# EAGLE design PiDuinoSerial (EAGLE 6.4)
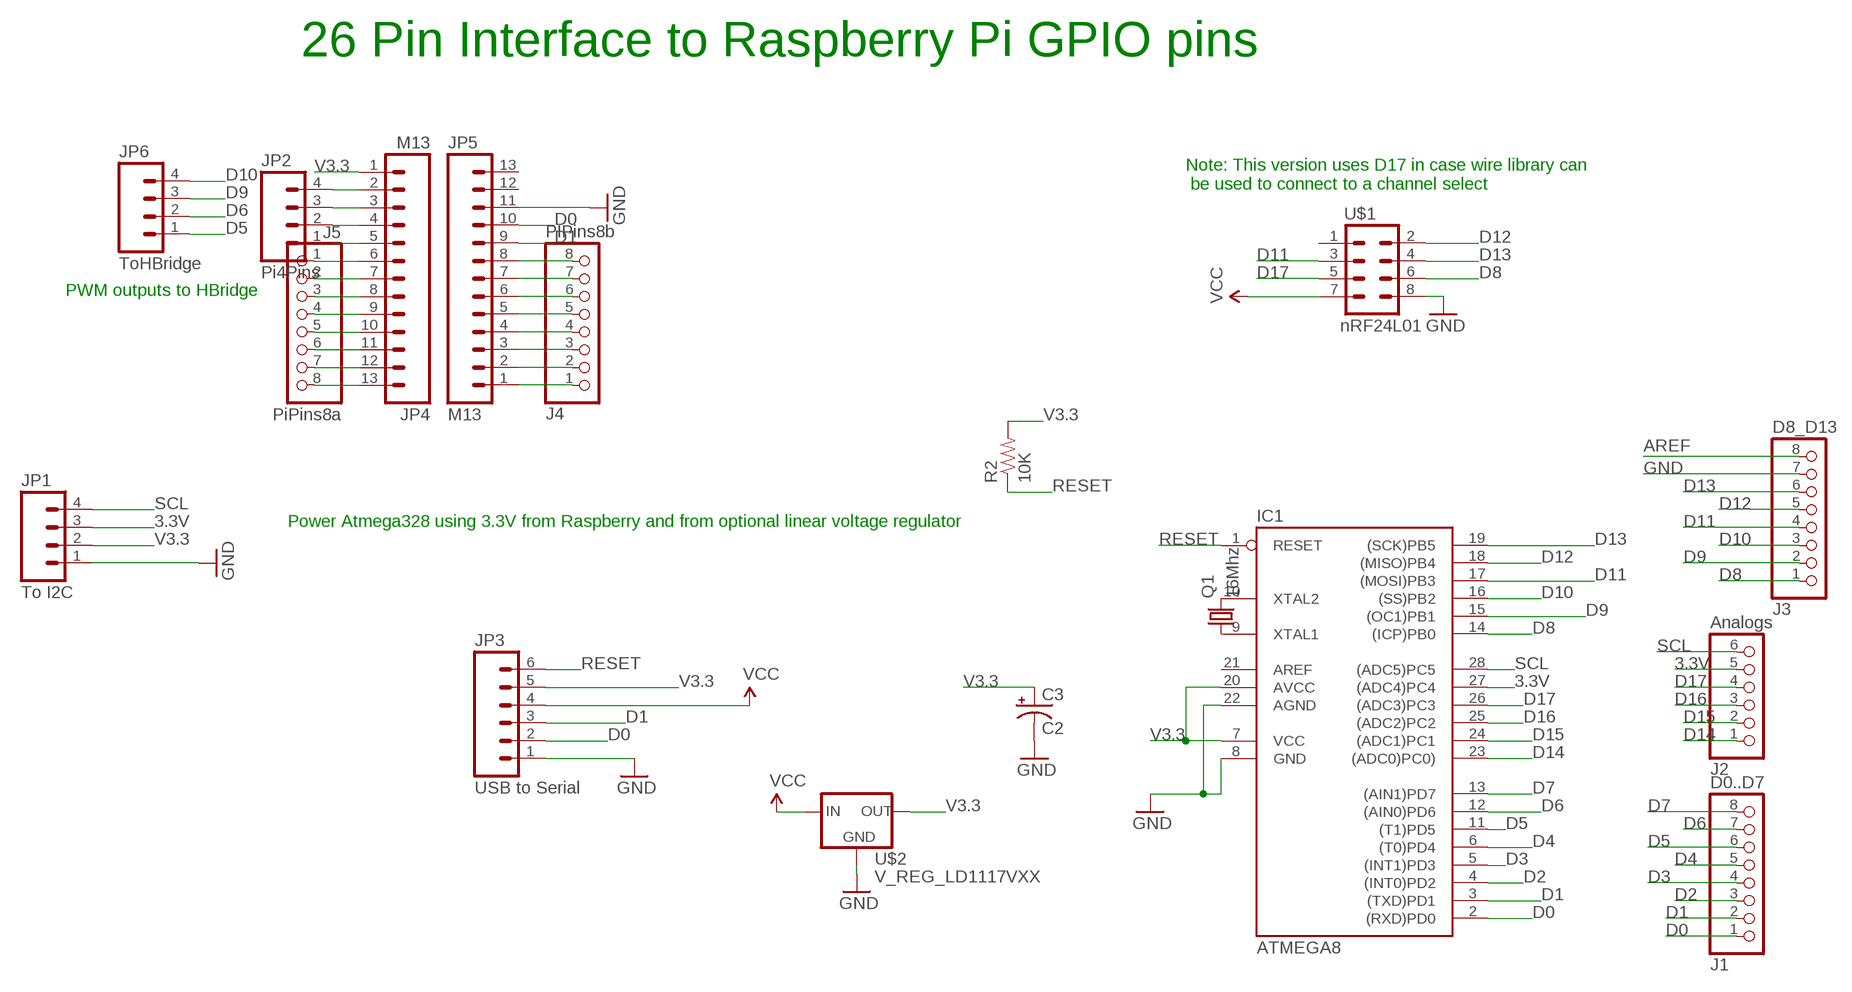
[diagram p0: schematic, sheet 1]

## Parts
C3  C2  CAP_POLPTH1  [CPOL-RADIAL-100UF-25V]
IC1  ATMEGA8  AT90S4433P  [DIL28-3]
J1  D0..D7  PINHD-1X8  [1X08]
J2  Analogs  PINHD-1X6  [1X06]
J3  D8_D13  PINHD-1X8  [1X08]
J4  PIPins8b  PINHD-1X8  [1X08]
J5  PiPins8a  PINHD-1X8  [1X08]
JP1  To I2C  M04PTH  [1X04]
JP2  Pi4Pins  M04PTH  [1X04]
JP3  USB to Serial  M06SIP  [1X06]
JP4  M13  [1X13]
JP5  M13  [1X13]
JP6  ToHBridge  M04PTH  [1X04]
Q1  16Mhz  CRYSTALHC49US  [HC49US]
R2  10K  RESISTORPTH1  [AXIAL-0.3]
U$1  nRF24L01  M04X2  [2X4]
U$2  V_REG_LD1117VXX  [78XXL]

## Nets
3.3V: IC1.27((ADC4)PC4) J2.5 JP1.3
AREF [aref]: J3.8
D0: IC1.2((RXD)PD0) J1.1 JP3.2 JP5.10
D1: IC1.3((TXD)PD1) J1.2 JP3.3 JP5.9
D2: IC1.4((INT0)PD2) J1.3
D3: IC1.5((INT1)PD3) J1.4
D4: IC1.6((T0)PD4) J1.5
D5: IC1.11((T1)PD5) J1.6 JP6.1
D6: IC1.12((AIN0)PD6) J1.7 JP6.2
D7: IC1.13((AIN1)PD7) J1.8
D8: IC1.14((ICP)PB0) J3.1 U$1.6
D9: IC1.15((OC1)PB1) J3.2 JP6.3
D10: IC1.16((SS)PB2) J3.3 JP6.4
D11: IC1.17((MOSI)PB3) J3.4 U$1.3
D12: IC1.18((MISO)PB4) J3.5 U$1.2
D13: IC1.19((SCK)PB5) J3.6 U$1.4
D14: IC1.23((ADC0)PC0)) J2.1
D15: IC1.24((ADC1)PC1) J2.2
D16: IC1.25((ADC2)PC2) J2.3
D17: IC1.26((ADC3)PC3) J2.4 U$1.5
GND [gnd]: C3.2(-) IC1.8(GND) IC1.22(AGND) J3.7 JP1.1 JP3.1 JP5.11 U$1.8 U$2.IN(GND)
N$1: IC1.10(XTAL2) Q1.2
N$2: IC1.9(XTAL1) Q1.1
N$3: J4.1 JP5.1
N$4: J4.2 JP5.2
N$5: J4.3 JP5.3
N$6: J4.4 JP5.4
N$7: J4.5 JP5.5
N$8: J4.6 JP5.6
N$9: J4.7 JP5.7
N$10: J4.8 JP5.8
N$11: J5.1 JP4.6
N$12: J5.2 JP4.7
N$13: J5.3 JP4.8
N$14: J5.4 JP4.9
N$15: J5.5 JP4.10
N$16: J5.6 JP4.11
N$17: J5.7 JP4.12
N$18: J5.8 JP4.13
N$19: JP2.1 JP4.5
N$20: JP2.2 JP4.4
N$21: JP2.3 JP4.3
N$22: JP2.4 JP4.2
RESET: IC1.1(RESET) JP3.6 R2.P$1
SCL: IC1.28((ADC5)PC5) J2.6 JP1.4
V3.3: C3.1(+) IC1.7(VCC) IC1.20(AVCC) JP1.2 JP3.5 JP4.1 R2.P$2 U$2.GND(OUT)
VCC: JP3.4 U$1.7 U$2.OUT(IN)
Unconnected: JP5.12 JP5.13 U$1.1

## Notes on the sheet
- 26 Pin Interface to Raspberry Pi GPIO pins
- Note: This version uses D17 in case wire library can
   be used to connect to a channel select
- PWM outputs to HBridge
- Power Atmega328 using 3.3V from Raspberry and from optional linear voltage regulator

## Power pins joined to a net without a drawn wire
AREF: IC1.21(AREF)

## Library data of the parts
C3 = SparkFun:CAP_POL: Capacitor Polarized These are standard SMD and PTH capacitors. Normally 10uF, 47uF, and 100uF in electrolytic and tantalum varieties. Always verify the external diameter of the through hole cap, it varies with capacity, voltage, and manufacturer. The EIA devices should be standard.
IC1 = atmel:AT90S4433: MICROCONTROLLER 4 Kbytes FLASH 128 bytes SRAM 256 bytes EEPROM UART 6-channel 10 bit ADC
J1 J3-J5 = pinhead:PINHD-1X8: PIN HEADER
J2 = pinhead:PINHD-1X6: PIN HEADER
JP1 JP2 JP6 = SparkFun-Connectors:M04: Header 4 Standard 4-pin 0.1" header. Use with straight break away headers (SKU : PRT-00116), right angle break away headers (PRT-00553), swiss pins (PRT-00743), machine pins (PRT-00117), and female headers (PRT-00115). Molex polarized connector foot print use with SKU : PRT-08231 with associated crimp pins and housings. 1MM SMD Version SKU: PRT-10208
JP3 = SparkFun:M06: Header 6 Standard 6-pin 0.1" header. Use with straight break away headers (SKU : PRT-00116), right angle break away headers (PRT-00553), swiss pins (PRT-00743), machine pins (PRT-00117), and female headers (PRT-00115). Molex polarized connector foot print use with SKU : PRT-08094 with associated crimp pins and housings. NOTES ON THE VARIANTS LOCK and LOCK_LONGPADS... This footprint was designed to help hold the alignment of a through-hole component (i.e. 6-pin header) while soldering it into place. You may notice that each hole has been shifted either up or down by 0.005 of an inch from it's more standard position (which is a perfectly straight line). This slight alteration caused the pins (the squares in the middle) to touch the edges of the holes. Because they are alternating, it causes a "brace" to hold the component in place. 0.005 has proven to be the perfect amount of "off-center" position when using our standard breakaway headers. Although looks a little odd when you look at the bare footprint, once you have a header in there, the alteration is very hard to notice. Also, if you push a header all the way into place, it is covered up entirely on the bottom side. This idea of altering the position of holes to aid alignment will be further integrated into the Sparkfun Library for other footprints. It can help hold any component with 3 or more connection pins.
JP4 JP5 = SparkFun-Connectors:M13: 13-pin single row .1" header
Q1 = SparkFun:CRYSTAL: Crystals Various standard crystals. Proven footprints. Spark Fun Electronics SKU : COM-00534
R2 = SparkFun:RESISTOR: Resistor Basic schematic elements and footprints for 0603, 1206, and PTH 1/10th watt (small) resistors.
U$1 = SparkFun-Connectors:M04X2: .1" header, two rows of four.
U$2 = SparkFun-PowerIC:V_REG_LD1117VXX: LD1117VXX voltage regulator. We carry the 3.3V version (COM-00526) in TO-220 package.

## Net classes
0 default: width 0.254 mm, clearance 0.254 mm
1 power: width 0.61 mm, drill 0.711 mm, clearance 0.33 mm
2 gnd: width 0.305 mm, drill 0.711 mm, clearance 0.254 mm
3 usbvcc: width 0.508 mm, drill 0.711 mm, clearance 0.254 mm
4 aref: width 0.406 mm

## Board
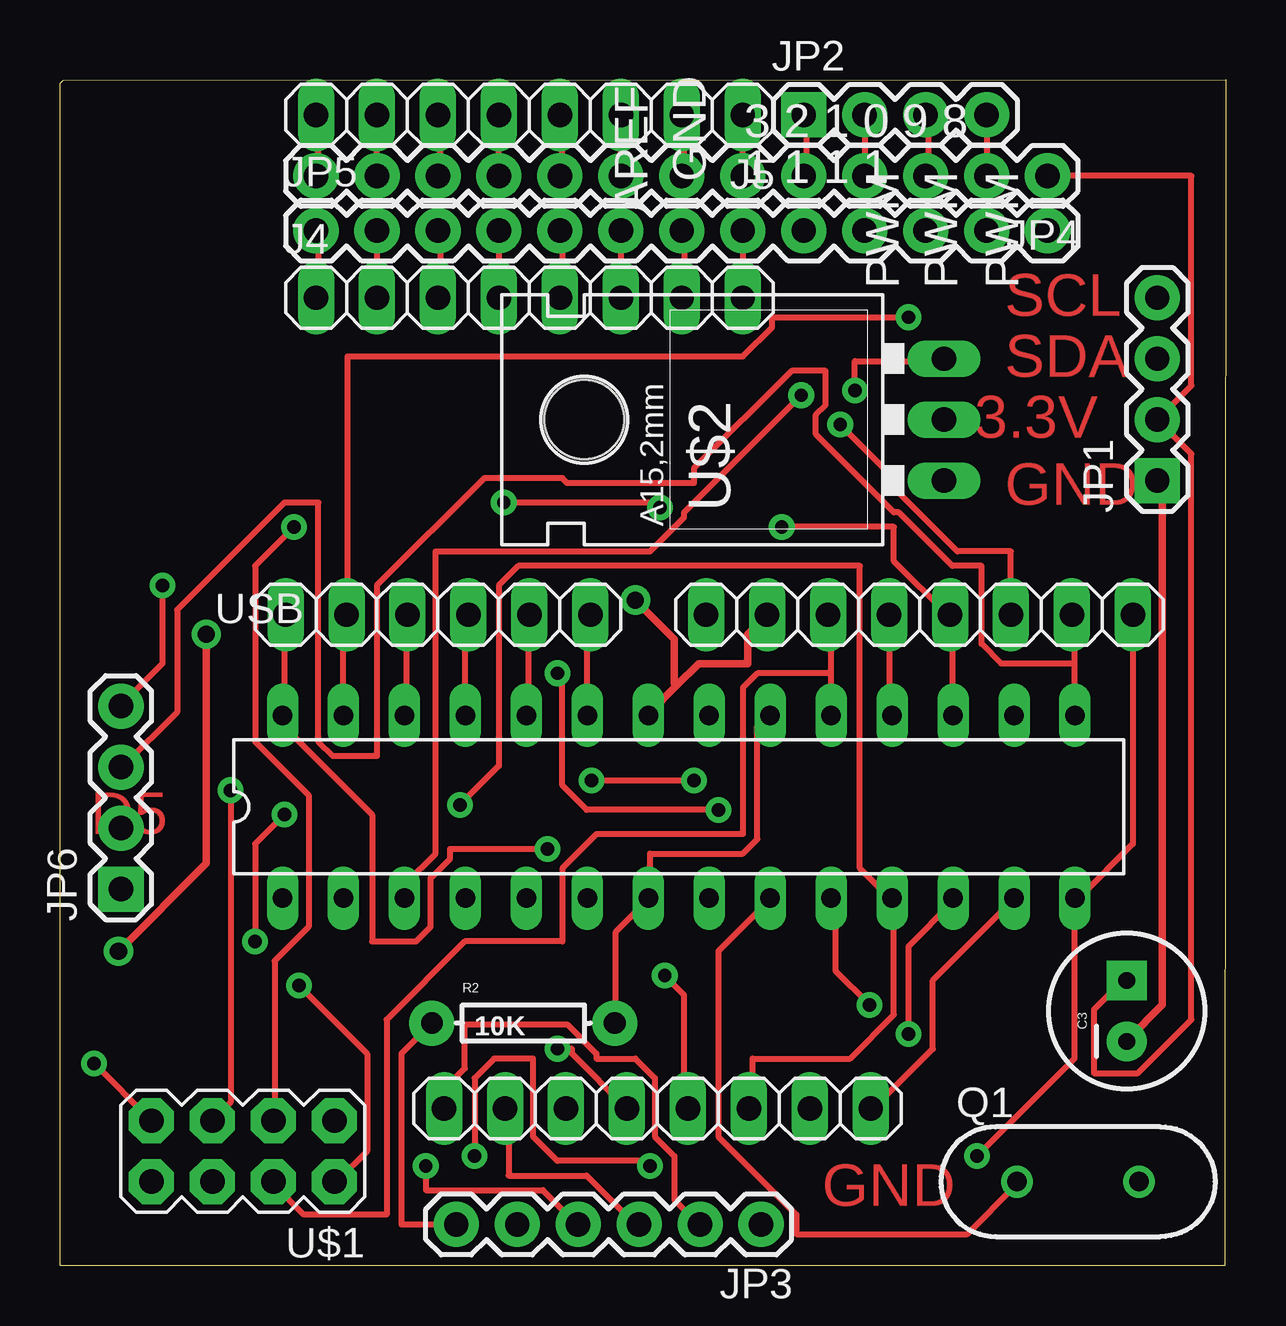
[diagram p1: board, top side]
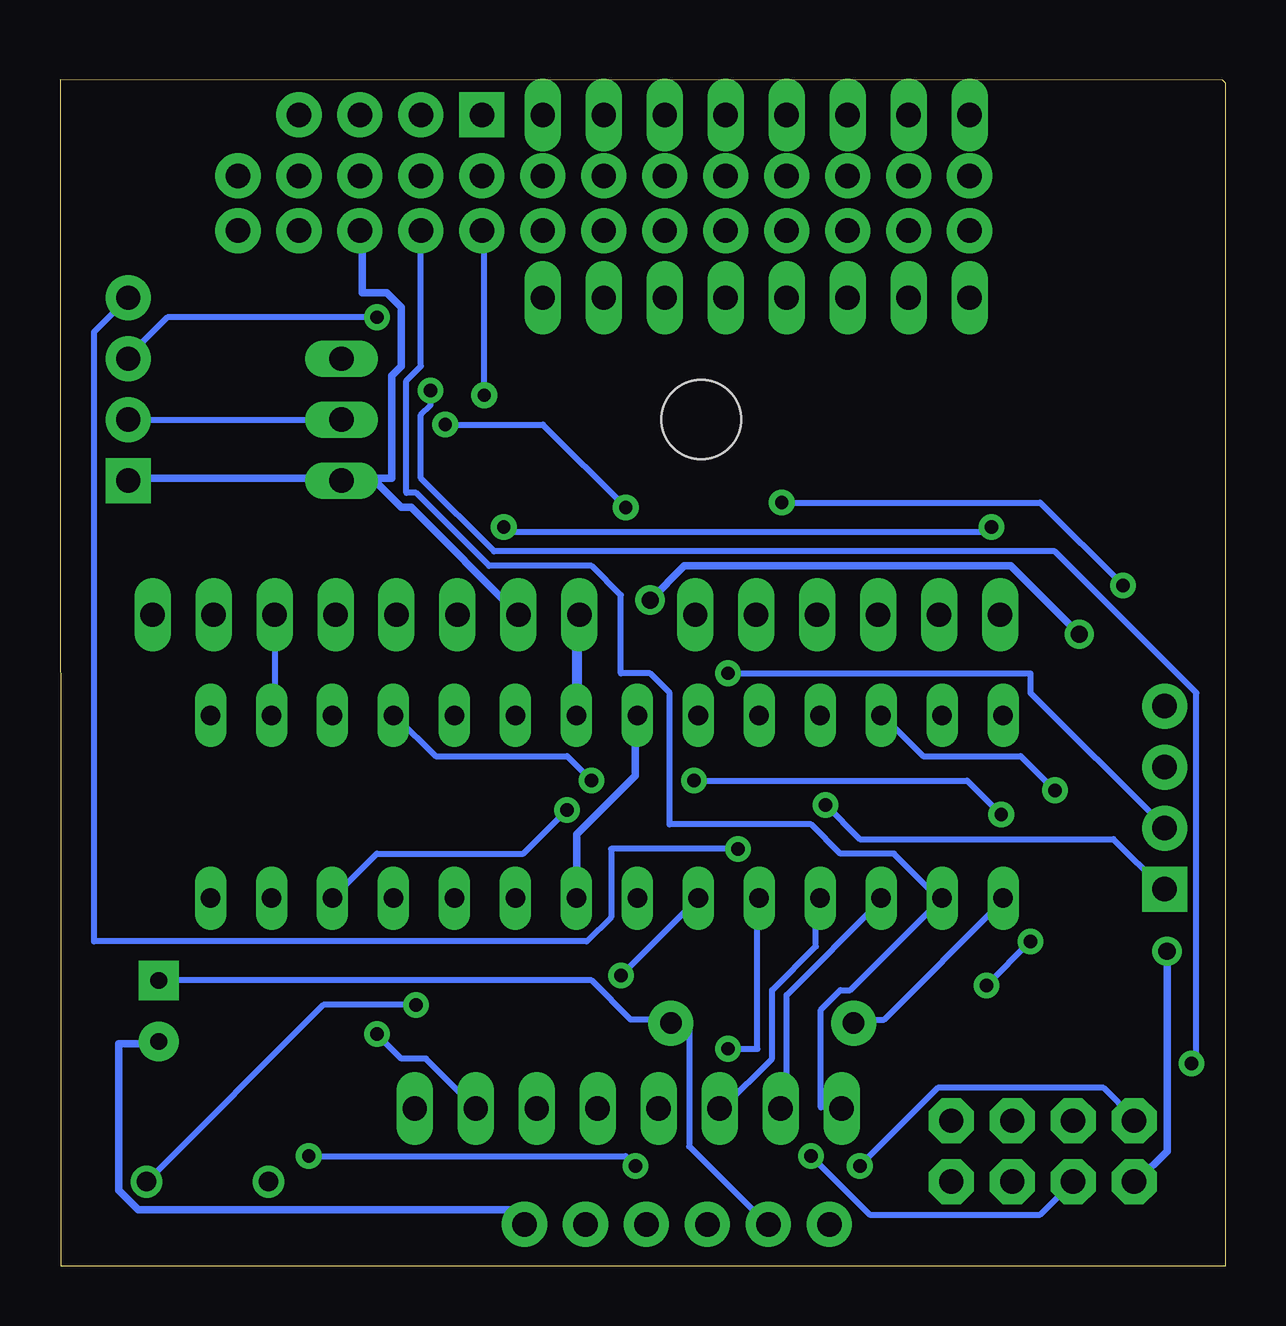
[diagram p2: board, bottom side, seen from below]

Size 48.56 x 49.43 mm. Coordinates in mm from the lower left corner, seen from the top.
Outline: 0,49.28 0.13,49.4 48.56,49.43 48.54,0 0,0 0,49.28
Copper layers (1*16): Top 0.035mm / dielectric 1.5mm / Bottom 0.035mm
Design rules "default": minimum track width 10mil, minimum drill 22mil, track to track 10mil, track to pad 10mil, pad to pad 10mil, via to via 16mil, smd to smd 8mil, copper to edge 30mil, drill to drill 12mil, minimum pad ring 10mil, minimum via ring 10mil, stop-mask expansion 4mil, vias tented up to drill 0mil, thermal gap 10mil
vRestrict: area 25.4,45.2 to 27.1,48.8; area 33.4,40.7 to 34.9,44.3; area 35.9,40.7 to 37.5,44.3; area 38.5,40.7 to 40,44.3; area 42.5,38.3 to 43.1,38.6

### Footprints (pad centres in the part's own frame; a part is rotated, then mirrored left to right if it is on the bottom)
CPOL-RADIAL-100UF-25V = drill 0.7 pad 1.651 square: 1 1.27,0 | drill 0.7 pad 1.651: 2 -1.27,0
DIL28-3 = drill 0.813 long: 1 -16.51,-3.81; 2 -13.97,-3.81; 3 -11.43,-3.81; 4 -8.89,-3.81; 5 -6.35,-3.81; 6 -3.81,-3.81; 7 -1.27,-3.81; 8 1.27,-3.81; 9 3.81,-3.81; 10 6.35,-3.81; 11 8.89,-3.81; 12 11.43,-3.81; 13 13.97,-3.81; 14 16.51,-3.81; 15 16.51,3.81; 16 13.97,3.81; 17 11.43,3.81; 18 8.89,3.81; 19 6.35,3.81; 20 3.81,3.81; 21 1.27,3.81; 22 -1.27,3.81; 23 -3.81,3.81; 24 -6.35,3.81; 25 -8.89,3.81; 26 -11.43,3.81; 27 -13.97,3.81; 28 -16.51,3.81
1X08 = drill 1.016 long: 1 -8.89,0; 2 -6.35,0; 3 -3.81,0; 4 -1.27,0; 5 1.27,0; 6 3.81,0; 7 6.35,0; 8 8.89,0
1X06 = drill 1.016 long: 1 -6.35,0; 2 -3.81,0; 3 -1.27,0; 4 1.27,0; 5 3.81,0; 6 6.35,0
1X04 = drill 1.016 pad 1.88 square: 1 0,0 | drill 1.016 pad 1.88: 2 2.54,0; 3 5.08,0; 4 7.62,0
1X06' = drill 1.016 pad 1.88: 1 0,0; 2 2.54,0; 3 5.08,0; 4 7.62,0; 5 10.16,0; 6 12.7,0
1X13 = drill 1.016 pad 1.88: 1 0,0; 2 2.54,0; 3 5.08,0; 4 7.62,0; 5 10.16,0; 6 12.7,0; 7 15.24,0; 8 17.78,0; 9 20.32,0; 10 22.86,0; 11 25.4,0; 12 27.94,0; 13 30.48,0
HC49US = drill 0.813: 1 -2.54,0; 2 2.54,0
AXIAL-0.3 = drill 0.9 pad 1.88: P$1 -3.81,0; P$2 3.81,0
2X4 = drill 1.016 pad 1.88 octagon: 1 -3.81,-1.27; 2 -3.81,1.27; 3 -1.27,-1.27; 4 -1.27,1.27; 5 1.27,-1.27; 6 1.27,1.27; 7 3.81,-1.27; 8 3.81,1.27
78XXL = drill 1.016 long: GND 0,-3.81; IN -2.54,-3.81; OUT 2.54,-3.81 | hole 3.302: 0,11.176

### Placement (x,y rotation side)
C3  44.45,10.62 90 top
IC1  25.78,19.13 0 top
J1  24.89,6.55 0 top
J2  15.75,27.13 180 top
J3  35.81,27.13 180 top
J4  19.56,40.34 0 top
J5  19.56,47.96 180 top
JP1  45.72,32.72 90 top
JP2  30.99,47.96 0 top
JP3  USB to Serial  [1X06']  29.21,1.73 180 top
JP4  41.15,45.42 180 top
JP5  10.67,43.13 0 top
JP6  2.54,15.7 90 top
Q1  42.42,3.51 0 top
R2  19.3,10.11 0 top
U$1  7.62,4.78 180 top
U$2  33.02,35.26 90 top

### Tracks (layer width: path | path; a pad name or v marks a point on that pad's centre or on a via)
3.3V  (via drill 0.56)
  Top 0.254: IC1.27 11.79,23.06 11.79,27.13 J2.5 11.99,27.13 11.99,37.9 28.45,37.9 29.67,39.12 29.67,39.52 v35.36,39.52
  Bottom 0.254: v35.36,39.52 44.09,39.52 45.72,37.9 JP1.3
AREF
  Bottom 0.406: IC1.21 27.03,23.06 27.03,27.13 J3.8
D0
  Top 0.254: JP3.2 26.62,1.73 25.6,2.74 25.6,4.57 24.79,5.39 24.79,7.82 23.98,8.64 22.35,8.64 22.35,8.84 21.13,10.06 16.87,10.06 16.87,8.23 16.05,7.42 16.05,6.6 J1.1
  Bottom 0.254: J1.1 16.05,6.6 16.87,6.6 16.87,10.67 16.05,11.48 15.65,11.48 IC1.2 11.99,15.34 13.82,17.17 16.05,17.17 17.27,18.39 23.16,18.39 23.16,23.88 23.98,24.69 25.2,24.69 25.2,27.94 26.42,29.16 30.68,29.16 33.73,32.21 34.14,32.21 34.14,36.88 33.53,37.49 JP5.10
D1  (via drill 0.56)
  Top 0.254: JP3.3 23.98,1.73 21.95,3.76 18.69,3.76 18.69,6.4 J1.2 | v30.89,36.27 26.01,31.39 26.01,31.19 24.59,29.77 15.65,29.77 15.65,17.17 14.43,15.95 14.43,15.34 IC1.3
  Bottom 0.254: IC1.3 14.43,15.14 18.29,11.28 18.29,6.6 18.49,6.6 J1.2 | v30.89,36.27 30.89,42.98 JP5.9
D2
  Bottom 0.254: IC1.4 17.07,15.14 17.07,13.31 18.9,11.48 18.9,8.64 20.93,6.6 J1.3
D3  (via drill 0.56)
  Top 0.254: v20.73,9.04 21.34,9.04 21.34,8.84 J1.4
  Bottom 0.254: v20.73,9.04 19.51,9.04 19.51,15.14 IC1.5
D4  (via drill 0.56)
  Top 0.254: v25.2,12.09 26.01,11.28 26.01,6.6 J1.5
  Bottom 0.254: v25.2,12.09 IC1.6
D5  (via drill 0.56)
  Top 0.254: J1.6 28.85,6.6 28.85,8.64 32.92,8.64 34.75,10.47 34.75,15.14 IC1.11 34.54,15.34 33.33,16.56 33.33,29.16 19.1,29.16 18.29,28.35 18.29,20.83 v16.66,19.2
  Bottom 0.254: v16.66,19.2 15.24,17.78 4.67,17.78 2.64,15.75 JP6.1
D6  (via drill 0.56)
  Top 0.254: v35.36,9.65 35.36,13.31 37.19,15.14 IC1.12 | v20.73,24.69 20.93,24.49 20.93,20.02 21.95,19 v27.43,19
  Bottom 0.254: v35.36,9.65 34.34,8.64 33.33,8.64 J1.7 | v20.73,24.69 8.13,24.69 8.13,23.88 2.64,18.39 JP6.2 | v27.43,19 29.26,17.17 35.36,17.17 IC1.12
D7
  Top 0.254: IC1.13 39.62,15.14 36.37,11.89 36.37,9.04 33.93,6.6 J1.8
D8  (via drill 0.56)
  Top 0.254: J3.1 44.7,17.58 42.47,15.34 IC1.14 42.27,15.14 42.27,8.64 v38.2,4.57 | v17.27,4.57 17.27,7.82 18.09,8.64 19.71,8.64 19.71,5.39 20.73,4.37 24.59,4.37 v24.59,4.17
  Bottom 0.254: U$1.6 7.72,2.13 14.83,2.13 v17.27,4.57 | v24.59,4.17 24.99,4.57 v38.2,4.57
D9
  Top 0.254: 42.27,25.1 42.27,27.13 J3.2 | 42.27,25.1 42.27,23.06 IC1.15 | 42.27,25.1 39.22,25.1 38.41,25.91 38.41,29.16 37.19,29.16 34.95,31.39 34.75,31.39 31.5,34.65 31.5,35.46 31.9,35.87 31.9,37.29 30.48,37.29 26.42,33.22 26.42,32.61 21.13,32.61 20.93,32.82 17.68,32.82 13.21,28.35 13.21,21.23 11.38,21.23 10.77,21.84 10.77,31.8 9.35,31.8 4.88,27.33 4.88,23.06 2.64,20.83 JP6.3
D10  (via drill 0.56)
  Top 0.254: v4.27,28.35 4.27,25.1 2.64,23.47 JP6.4 | v18.49,31.8 24.99,31.8 v24.99,31.6 | v32.51,35.05 34.75,32.82 34.75,32.41 37.39,29.77 39.62,29.77 J3.3
  Bottom 0.254: J3.3 39.62,23.06 IC1.16 | v4.27,28.35 7.72,31.8 v18.49,31.8 | v24.99,31.6 28.45,35.05 v32.51,35.05
D11  (via drill 0.56)
  Top 0.254: IC1.17 37.19,23.06 37.19,27.13 J3.4 36.98,27.13 34.75,29.36 34.75,30.79 v30.07,30.79 | v9.75,30.79 8.13,29.16 8.13,21.84 10.36,19.61 10.36,14.12 8.94,12.7 8.94,6.2 U$1.3
  Bottom 0.254: v9.75,30.79 9.96,30.58 29.87,30.58 v30.07,30.79
D12  (via drill 0.56)
  Top 0.254: J3.5 34.54,23.06 IC1.18 | v9.96,11.68 12.8,8.84 12.8,4.78 11.58,3.56 U$1.2 | v8.13,13.51 8.13,17.58 v9.35,18.8 | v26.42,20.22 v22.15,20.22
  Bottom 0.254: v8.13,13.51 v9.96,11.68 | v9.35,18.8 10.77,20.22 v22.15,20.22 | v26.42,20.22 27.43,21.23 32.92,21.23 34.54,22.86 IC1.18
D13
  Top 0.254: 32.11,24.69 32.11,27.13 J3.6 | 32.11,24.69 32.11,23.06 IC1.19 | 32.11,24.69 29.06,24.69 28.45,24.08 28.45,17.98 22.35,17.98 20.93,16.56 20.93,13.51 16.87,13.51 13.61,10.26 13.61,2.13 10.16,2.13 8.94,3.35 U$1.4
D14
  Top 0.254: IC1.23 21.95,23.06 21.95,27.13 J2.1
D15
  Top 0.254: IC1.24 19.51,23.06 19.51,27.13 J2.2
D16
  Top 0.254: IC1.25 16.87,23.06 16.87,27.13 J2.3
D17  (via drill 0.56)
  Top 0.254: IC1.26 14.43,23.06 14.43,27.13 J2.4 | U$1.5 7.11,6.81 v7.11,19.81
  Bottom 0.254: v7.11,19.81 8.53,21.23 12.6,21.23 14.22,22.86 IC1.26
GND  (via drill 0.71)
  Top 0.305: 25.7,24.18 26.62,25.1 28.65,25.1 28.65,26.31 J3.7 | 25.7,24.18 24.59,23.06 IC1.22 | v2.44,13.11 6.1,16.76 v6.1,26.31 | v23.98,27.74 25.6,26.11 25.6,24.28 25.7,24.18 | C3.2 44.5,9.45 45.92,10.87 45.92,32.41 45.72,32.61 JP1.1
  Bottom 0.305: IC1.8 27.03,15.34 27.03,17.98 24.59,20.42 24.59,22.86 IC1.22 | v2.44,13.11 2.44,4.78 3.66,3.56 U$1.8 | v6.1,26.31 8.94,29.16 22.55,29.16 v23.98,27.74 | U$2.IN 36.98,32.82 45.72,32.82 JP1.1 | JP3.1 29.26,1.73 29.87,2.34 45.31,2.34 46.13,3.15 46.13,9.25 44.5,9.25 C3.2 | 35.56,32.82 36.78,32.82 U$2.IN | 35.56,32.82 34.75,32.82 34.75,37.08 34.34,37.49 34.34,39.93 34.95,40.54 35.97,40.54 35.97,42.98 JP5.11 | J3.7 33.93,31.6 34.34,31.6 35.56,32.82 | 35.56,32.82 U$2.IN
N$1  (via drill 0.56)
  Top 0.254: v33.73,10.87 32.31,12.29 32.31,15.14 IC1.10
  Bottom 0.254: Q1.2 37.59,10.87 v33.73,10.87
N$2
  Top 0.254: Q1.1 39.83,3.35 37.8,1.32 30.68,1.32 30.68,2.13 27.43,5.39 27.43,13.11 29.46,15.14 IC1.9
N$3
  Top 0.254: J4.1 10.77,40.34 10.77,42.98 JP5.1
N$4
  Top 0.254: JP5.2 J4.2
N$5
  Top 0.254: J4.3 15.85,40.34 15.85,42.98 JP5.3
N$6
  Top 0.254: JP5.4 J4.4
N$7
  Top 0.254: J4.5 20.93,40.34 20.93,42.98 JP5.5
N$8
  Top 0.254: JP5.6 J4.6
N$9
  Top 0.254: J4.7 26.01,40.34 26.01,42.98 JP5.7
N$10
  Top 0.254: JP5.8 J4.8
N$11
  Top 0.254: JP4.6 J5.1
N$12
  Top 0.254: J5.2 26.01,47.85 26.01,45.42 JP4.7
N$13
  Top 0.254: JP4.8 J5.3
N$14
  Top 0.254: J5.4 20.93,47.85 20.93,45.42 JP4.9
N$15
  Top 0.254: JP4.10 J5.5
N$16
  Top 0.254: J5.6 15.85,47.85 15.85,45.42 JP4.11
N$17
  Top 0.254: JP4.12 J5.7
N$18
  Top 0.254: J5.8 10.77,47.85 10.77,45.42 JP4.13
N$19
  Top 0.254: JP4.5 31.09,45.42 31.09,47.85 JP2.1
N$20
  Top 0.254: JP2.2 JP4.4
N$21
  Top 0.254: JP4.3 36.17,45.42 36.17,47.85 JP2.3
N$22
  Top 0.254: JP2.4 JP4.2
RESET
  Top 0.254: JP3.6 14.22,1.73 14.22,8.84 R2.P$1
  Bottom 0.254: IC1.1 9.35,15.14 14.22,10.26 15.44,10.26 R2.P$1
SCL  (via drill 0.56)
  Top 0.254: J2.6 9.35,27.13 9.35,23.06 IC1.28 9.35,22.86 9.35,22.45 13.01,18.8 13.01,13.51 14.83,13.51 15.44,14.12 15.44,16.15 16.26,16.97 16.26,17.37 v20.32,17.37
  Bottom 0.254: JP1.4 47.14,38.91 47.14,13.51 26.62,13.51 25.6,14.53 25.6,17.37 v20.32,17.37
V3.3
  Top 0.254: JP4.1 47.14,45.42 47.14,36.68 JP1.2 47.14,33.83 47.14,10.26 44.91,8.03 43.08,8.03 43.08,10.67 44.3,11.89 C3.1 | R2.P$2 23.16,10.26 23.16,13.92 24.38,15.14 IC1.7 24.59,15.34 24.59,17.17 28.45,17.17 29.06,17.78 29.06,22.45 29.46,22.86 IC1.20
  Bottom 0.254: JP1.2 U$2.GND | C3.1 26.42,11.89 24.79,10.26 23.16,10.26 R2.P$2 22.96,10.06 22.35,10.06 22.35,4.98 19.1,1.73 JP3.5
VCC  (via drill 0.56)
  Top 0.254: v33.12,36.47 33.12,37.69 36.78,37.69 U$2.OUT | U$1.7 v1.42,8.43 | v15.24,4.17 15.24,3.15 20.12,3.15 21.54,1.73 JP3.4
  Bottom 0.254: v33.12,36.47 33.12,35.87 33.53,35.46 33.53,32.82 30.48,29.77 7.11,29.77 1.22,23.88 1.22,8.43 v1.42,8.43 | v15.24,4.17 11.99,7.42 5.08,7.42 3.86,6.2 U$1.7

### Text on the board
Top: SCL | SDA | 3.3V | GND | D5 | GND
tNames: 3 2 1 0 9 8 | GND | 1 1 1 1 | AREF | PWM | PWM | PWM | USB
Reference: C8 | C2 | R11 | C4 | C5